# EAGLE design rng (EAGLE 5.04)
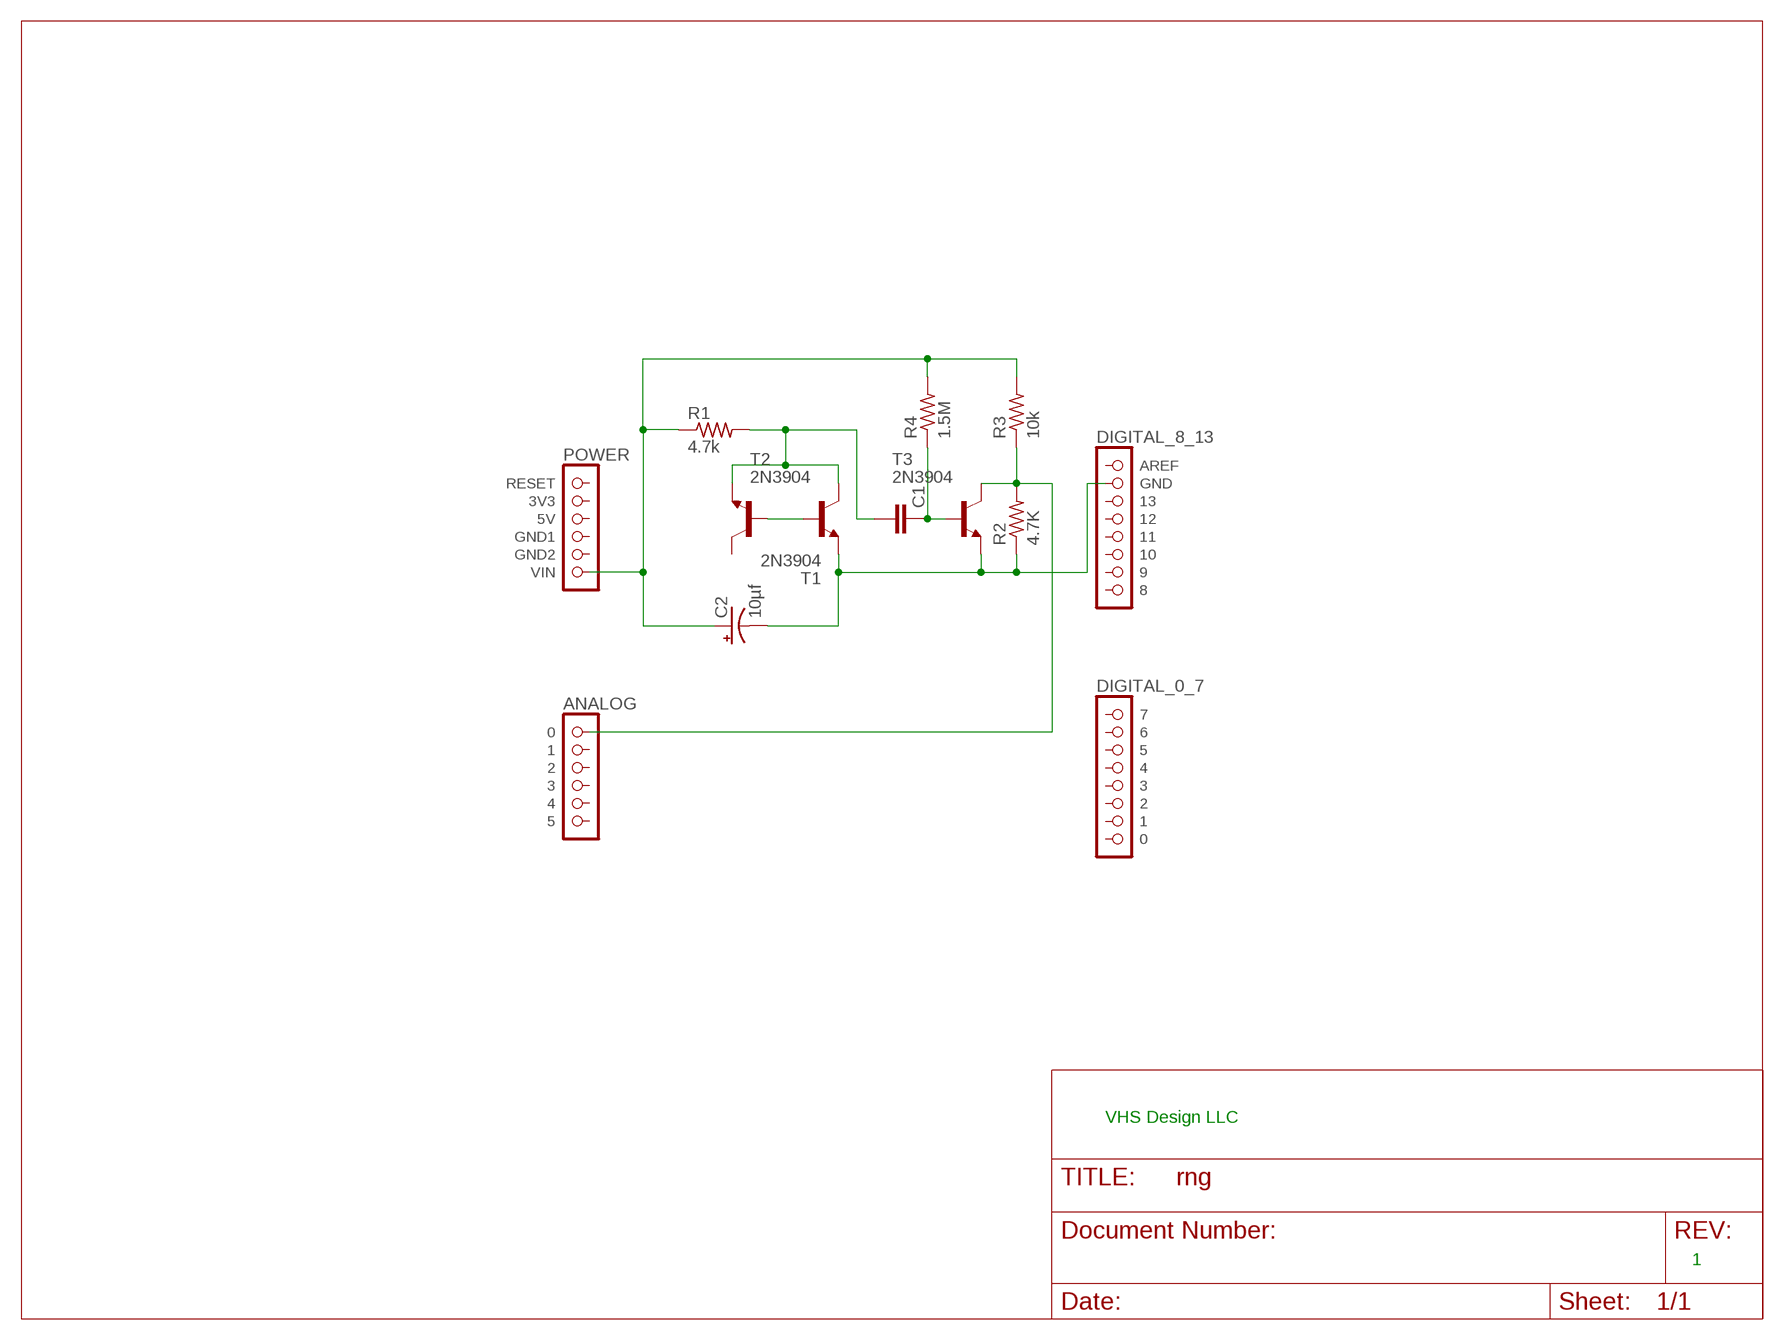
[diagram p0: schematic, sheet 1]

## Parts
C1  C2,5-3  [C2.5-3]
C2  10µf  CPOL-USE2.5-6  [E2,5-6]
R1  4.7k  R-US_0204/7  [0204/7]
R2  4.7K  R-US_0204/7  [0204/7]
R3  10k  R-US_0204/7  [0204/7]
R4  1.5M  R-US_0204/7  [0204/7]
T1  2N3904  [TO92]
T2  2N3904  [TO92]
T3  2N3904  [TO92]
U$1  POWER  [1X06]
U$2  ANALOG  [1X06]
U$3  DIGITAL_0_7  [1X08]
U$4  DIGITAL_8_13  [1X08]

## Nets
N$1: T1.2(B) T2.2(B)
N$2: C2.- R2.1 T2.3(E) T3.3(E) U$4.2(GND)
N$3: C1.2 R1.2 T1.3(E) T2.1(C)
N$4: C2.+ R1.1 R3.2 R4.2 U$1.6(VIN)
N$5: C1.1 R4.1 T3.2(B)
N$6: R2.2 R3.1 T3.1(C) U$2.1
Unconnected: T1.1(C) U$1.1(RESET) U$1.2(3V3) U$1.3(5V) U$1.4(GND1) U$1.5(GND2) U$2.2 U$2.3 U$2.4 U$2.5 U$2.6 U$3.1 U$3.2 U$3.3 U$3.4 U$3.5 U$3.6 U$3.7 U$3.8 U$4.1(AREF) U$4.3 U$4.4 U$4.5 U$4.6 U$4.7 U$4.8

## Notes on the sheet
- VHS Design LLC
- 1

## Library data of the parts
C1 = capacitor-wima:C: CAPACITOR naming: grid - package width
C2 = rcl:CPOL-US: POLARIZED CAPACITOR, American symbol
R1-R4 = rcl:R-US_: RESISTOR, American symbol
T1-T3 = transistor:2N3904: NPN TRANSISTOR
U$1 = arduino:POWER
U$2 = arduino:ANALOG
U$3 = arduino:DIGITAL_0_7
U$4 = arduino:DIGITAL_8_13

## Board
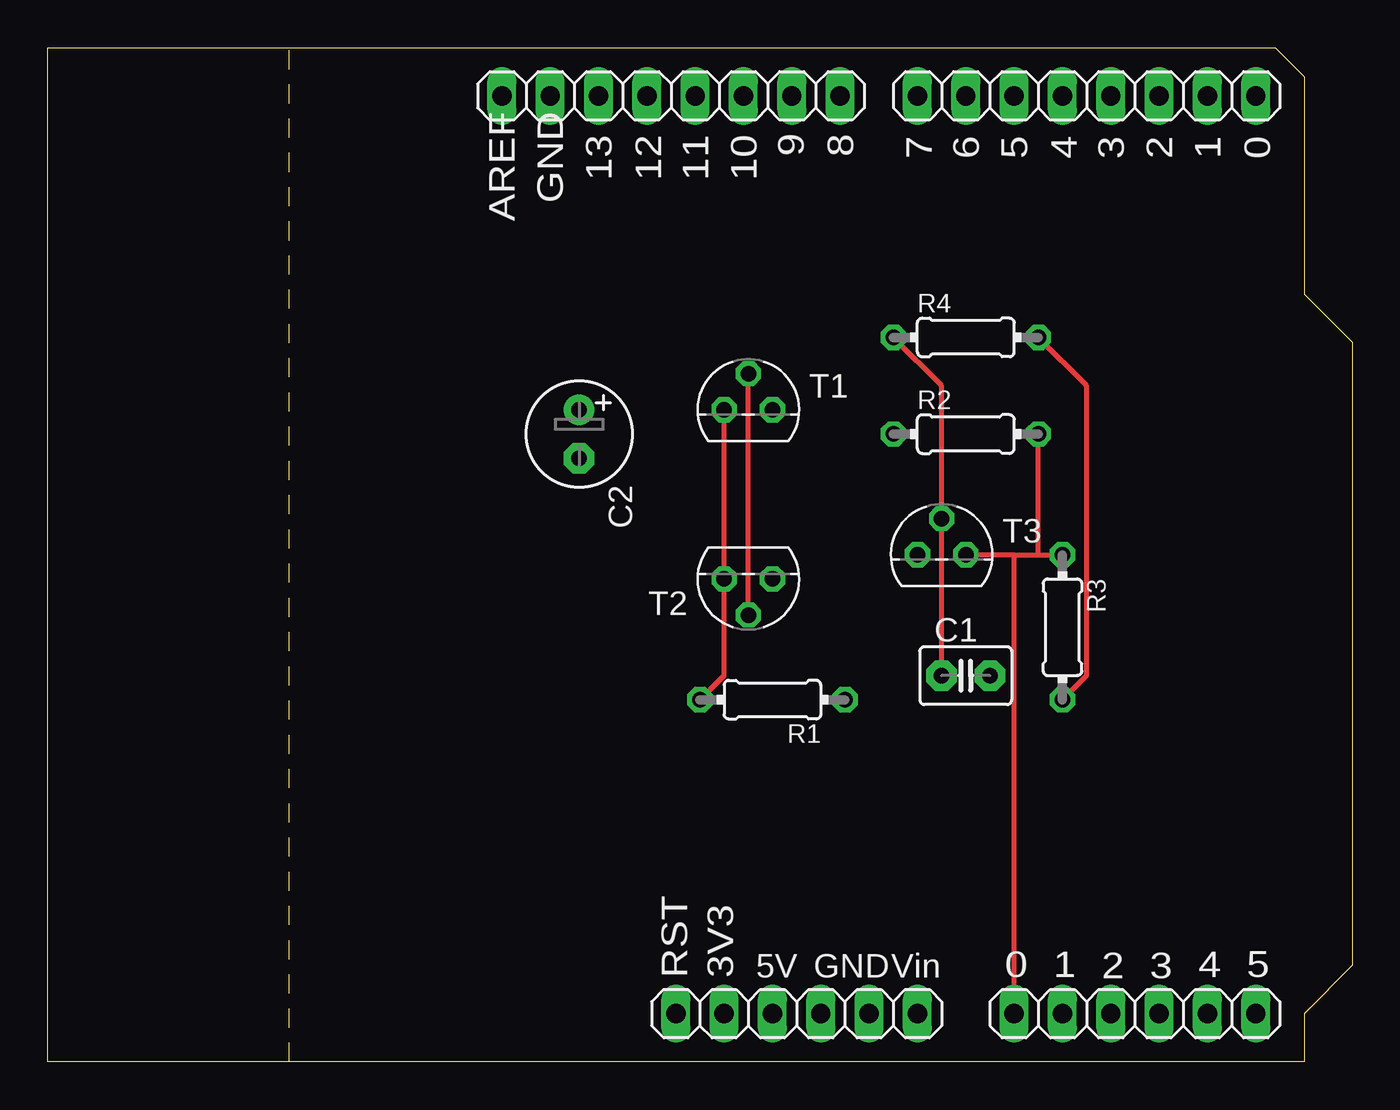
[diagram p1: board, top side]
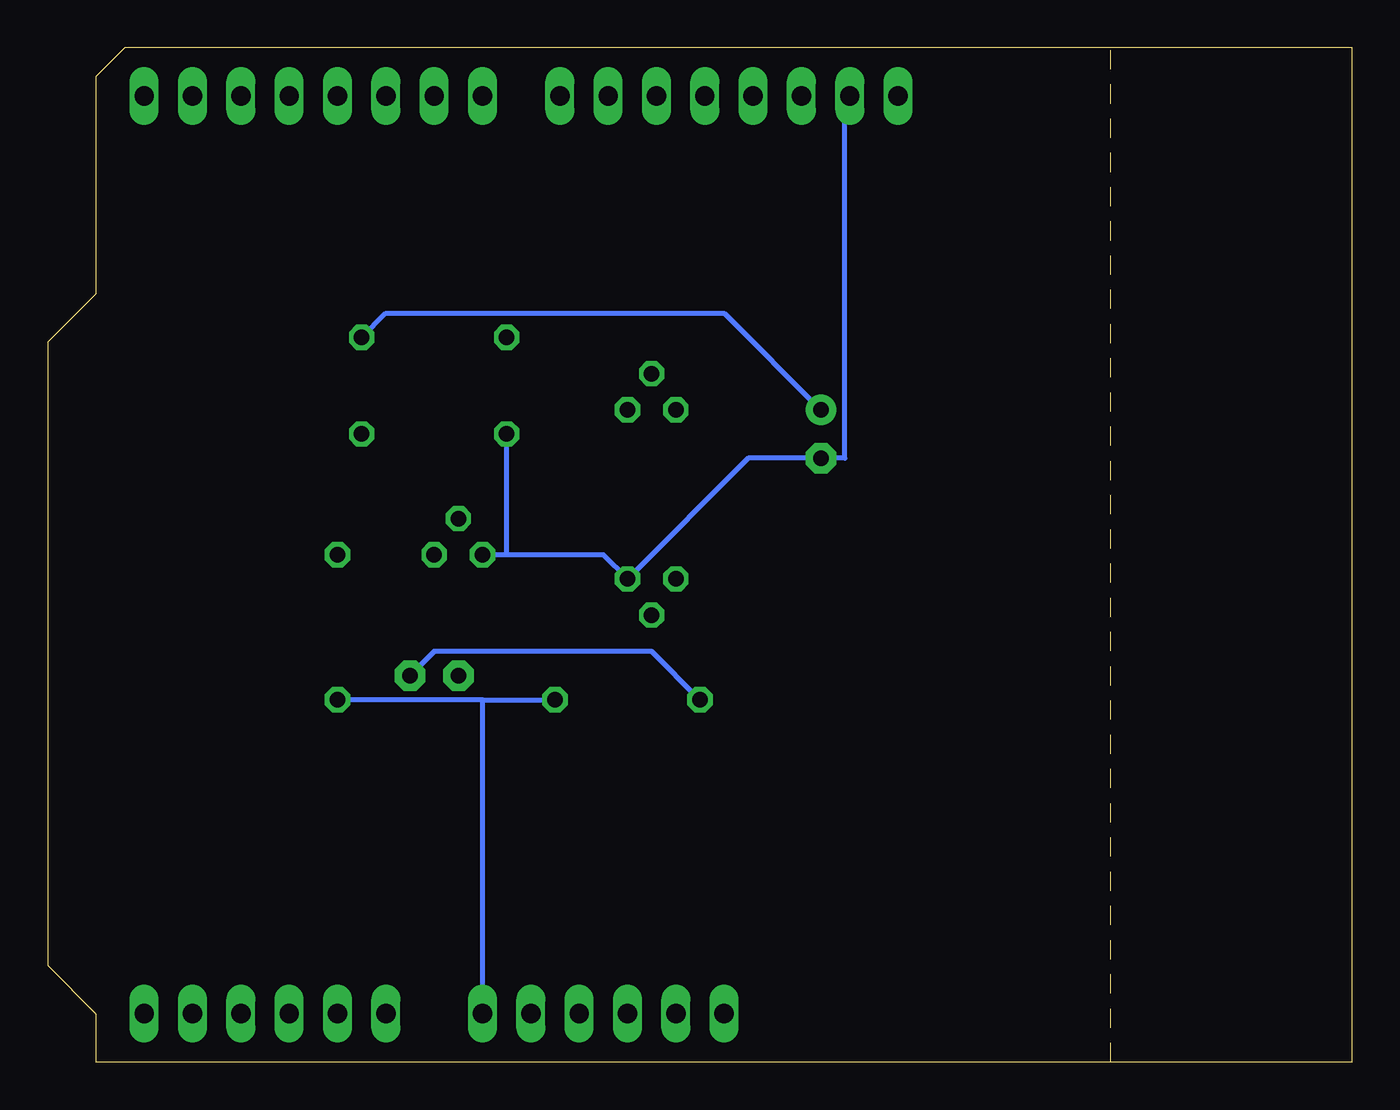
[diagram p2: board, bottom side, seen from below]

Size 68.58 x 53.34 mm. Coordinates in mm from the lower left corner, seen from the top.
Outline: 12.7,53.34 0,53.34 0,0 12.7,0
Outline: 12.7,53.34 64.52,53.34 66.04,51.82 66.04,40.39 68.58,37.85 68.58,5.08 66.04,2.54 66.04,0 12.7,0
Outline: 12.7,0 12.7,53.34
Copper layers (1*16): Top 0.035mm / dielectric 1.5mm / Bottom 0.035mm
Design rules "default": minimum track width 10mil, minimum drill 24mil, track to track 8mil, track to pad 8mil, pad to pad 8mil, via to via 8mil, smd to smd 8mil, copper to edge 40mil, drill to drill 8mil, minimum pad ring 10mil, minimum via ring 8mil, stop-mask expansion 4mil, vias tented up to drill 0mil, thermal gap 10mil

### Footprints (pad centres in the part's own frame; a part is rotated, then mirrored left to right if it is on the bottom)
C2.5-3 = drill 0.813 pad 1.6 octagon: 1 -1.27,0; 2 1.27,0
E2,5-6 = drill 0.813 pad 1.6 round: + -1.27,0 | drill 0.813 pad 1.6 octagon: - 1.27,0
0204/7 = drill 0.813 octagon: 1 -3.81,0; 2 3.81,0
TO92 = drill 0.813 octagon: 1 1.27,0; 2 0,1.905; 3 -1.27,0
1X06 = drill 1.016 long: 1 -6.35,0; 2 -3.81,0; 3 -1.27,0; 4 1.27,0; 5 3.81,0; 6 6.35,0
1X08 = drill 1.016 long: 1 -8.89,0; 2 -6.35,0; 3 -3.81,0; 4 -1.27,0; 5 1.27,0; 6 3.81,0; 7 6.35,0; 8 8.89,0

### Placement (x,y rotation side)
C1  48.26,20.32 0 top
C2  27.94,33.02 270 top
R1  38.1,19.05 180 top
R2  48.26,33.02 0 top
R3  53.34,22.86 270 top
R4  48.26,38.1 0 top
T1  36.83,34.29 0 top
T2  36.83,25.4 180 top
T3  46.99,26.67 0 top
U$1  39.37,2.54 0 top
U$2  57.15,2.54 0 top
U$3  54.61,50.8 0 top
U$4  32.77,50.8 0 top

### Tracks (layer width: path | path; a pad name or v marks a point on that pad's centre or on a via)
N$1
  Top 0.254: T2.2 T1.2
N$2
  Bottom 0.254: 44.45,26.67 T3.3 | 44.45,26.67 39.37,26.67 T2.3 31.75,31.75 C2.- 26.67,31.75 26.67,49.53 U$4.2 | 44.45,26.67 R2.1
N$3
  Top 0.254: R1.2 35.56,20.32 T2.1 T1.3
  Bottom 0.254: C1.2 48.26,21.59 36.83,21.59 R1.2
N$4
  Top 0.254: R4.2 54.61,35.56 54.61,20.32 R3.2
  Bottom 0.254: 45.72,19.05 R3.2 | 45.72,19.05 R1.1 | U$1.6 45.72,19.05 | C2.+ 33.02,39.37 50.8,39.37 R4.2
N$5
  Top 0.254: C1.1 T3.2 46.99,35.56 R4.1
N$6
  Top 0.254: 52.07,26.67 R3.1 | 50.8,26.67 52.07,26.67 | 50.8,26.67 T3.1 | 52.07,26.67 R2.2 | U$2.1 50.8,26.67

### Text on the board
tNames: 9 | 8 | 7 | 6 | 5 | 4 | 3 | 2 | 1 | 0 | 13 | 12 | 11 | 10 | GND | AREF | RST | 3V3 | 5V | GND | Vin | 0 | 1 | 2 | 3 | 4 | 5